# Altium project 15042021.PrjPcb
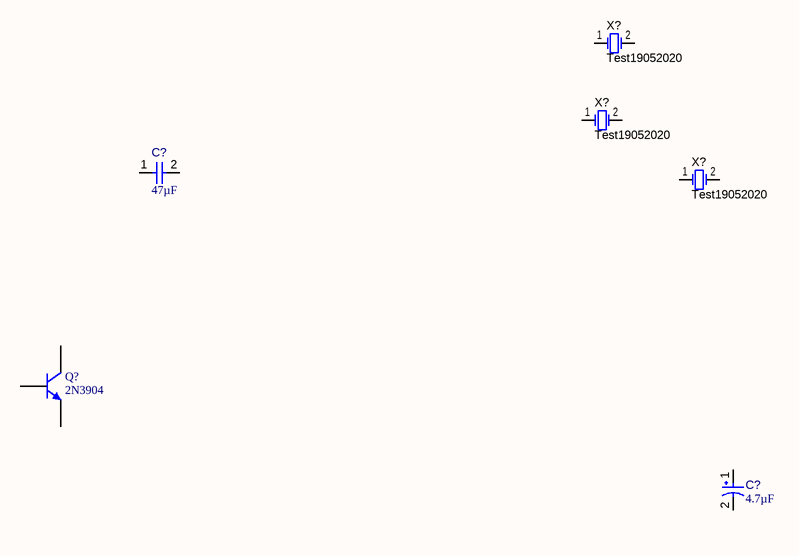
[diagram p0: Sheet1.SchDoc]
1 sheet, 6 parts. Net scope: global (net labels, ports and power ports of the same name join across sheets).
Board file: PCB1.PcbDoc

## Sheet Sheet1.SchDoc
size 431 x 279 mm; SheetNumber: 1; SheetTotal: 1; ENG_APP_DATE: --/--/--; DSN_APP_DATE: --/--/--; CHK_APP_DATE: --/--/--

### Parts
(Parts that share a designator on the sheet are numbered #1, #2 ... from top to bottom, then left to right.)
C?#1  value 47µF  [CAPC0805(2012)145_L]  (hidden comment: Capacitor 47µF +/-40% 6.3V 0805)
C?#2  value 4.7µF  [AVX-TAJ-A-2_M]  (hidden comment: TAJA475K016RNJ)
Q?  2N3904  [TO-92A]
X?#1  Test19052020  [ABRA-ABS07-2_V]
X?#2  Test19052020  [ABRA-ABS07-2_V]
X?#3  Test19052020  [ABRA-ABS07-2_V]

### Nets

Not connected (* = marked no-connect by the designer): C?#1 1 2; C?#2 1 2; Q? 1(E) 2(B) 3(C); X?#1 1(OSC1) 2(OSC2); X?#2 1(OSC1) 2(OSC2); X?#3 1(OSC1) 2(OSC2)

### Notes on the sheet
- 8
- 7
- 6
- 5
- 4
- 3
- DWG. NO.
- REV.
- SHT.
- 2
- 1
- THIS DOCUMENT AND THE DATA DISCLOSED HEREIN OR HEREWITH IS THE PROPERTY OF ALTIUM LIMITED AND MAY BE FREELY DISTRIBUTED IN WHOLE. NO RIGHTS ARE RESERVED OR EXPRESS OR IMPLIED WARANTEE GIVEN.
- REVISION
- DESCRIPTION
- DATE
- APPROVED
- F
- E
- D
- C
- B
- ENG:
- APPROVALS
- PROJECT
- SUITE 200
- 2175 SALK AVENUE
- CARLSBAD, CA 92008
- A
- DSN:
- CHK:
- REFERENCE DOCUMENTS
- PROJECT REVISION:
- TITLE
- DOCUMENT REVISION:
- DESIGN ITEM:
- USA
- BOM:
- FAB DWG:
- PCB DWG:
- ASSY DWG:
- SCALE:
- SIZE
- CAGE CODE
- FILE NAME
- DWG NO.
- SHEET
- OF
- REV

### Library data of the parts
C?#1 = CMP-001-00082-2: Chip Capacitor, 47µF +/-40%, 6.3V, 0805, Thickness 1.45 mm; Tolerance: 10%; Max Operating Temperature: 85°C; Case/Package: 0402; Min Operating Temperature: -55°C; Voltage Rating: 6.3V; Pins: 2; Mounting Technology: SMT
C?#2 = CMP-001-00042-5: Standard Tantalum, 4.7 uF, +/- 10%, 16 V, -55 to 125 degC, 1206 (3216 Metric), RoHS, Tape and Reel; Manufacturer: AVX; Resistance: 4Ohm; Voltage Rating: 16V; Capacitor Type: Tantalum; Manufacturer URL: http://www.avx.com/; Pins: 2; Case/Package: 1206; Mounting Technology: SM; Datasheet URL: http://datasheets.avx.com/TAJ.pdf; Datasheet Version: Feb-16; Tolerance: 10%; Packaging: TapeandReel; Package Reference: TAJ-A-2; RoHS Compliant: True; Min Operating Temperature: -55°C; ESR: 4Ohm; Package Quantity: 2000; Package Description: 2-Pin Surface Mount Device, Body 3.2 x 1.65 mm; Max Operating Temperature: 125°C
Q? = 2N3904: NPN General Purpose Amplifier; Published: 8-Jun-2000; LatestRevisionDate: 15-Jan-2003; LatestRevisionNote: PCB Footprint 'BCY-W3/D4.7' replaced; DatasheetVersion: 1997; PackageVersion: Sep-1998; PackageReference: TO-92A; Publisher: Altium Limited; PackageDescription: TO, Flat Index; 3 In-Line, Axial Leads; Body Dia. 4.5mm; Leads 0.51 x 0.48 mm (max); ComponentLink1Description: Manufacturer Link; ComponentLink1URL: http://www.fairchildsemi.com/; ComponentLink2Description: Datasheet; ComponentLink2URL: http://www.fairchildsemi.com/ds/2N%2F2N3904.pdf
X?#1-X?#3 = CMP-013-03649-1: Test19052020_description; Max Operating Temperature: 25°C